# EasyEDA Pro project FishyUSBHub.epro

# Schematic Schematic1
Board Name: Board1; Create Date: 2026-07-10; Page Name: P1; Project Name: USB Hub; Schematic Name: Schematic1; Update Date: 2026-07-10; Company: EasyEDA.com; Page Size: A4; Version: V1.0
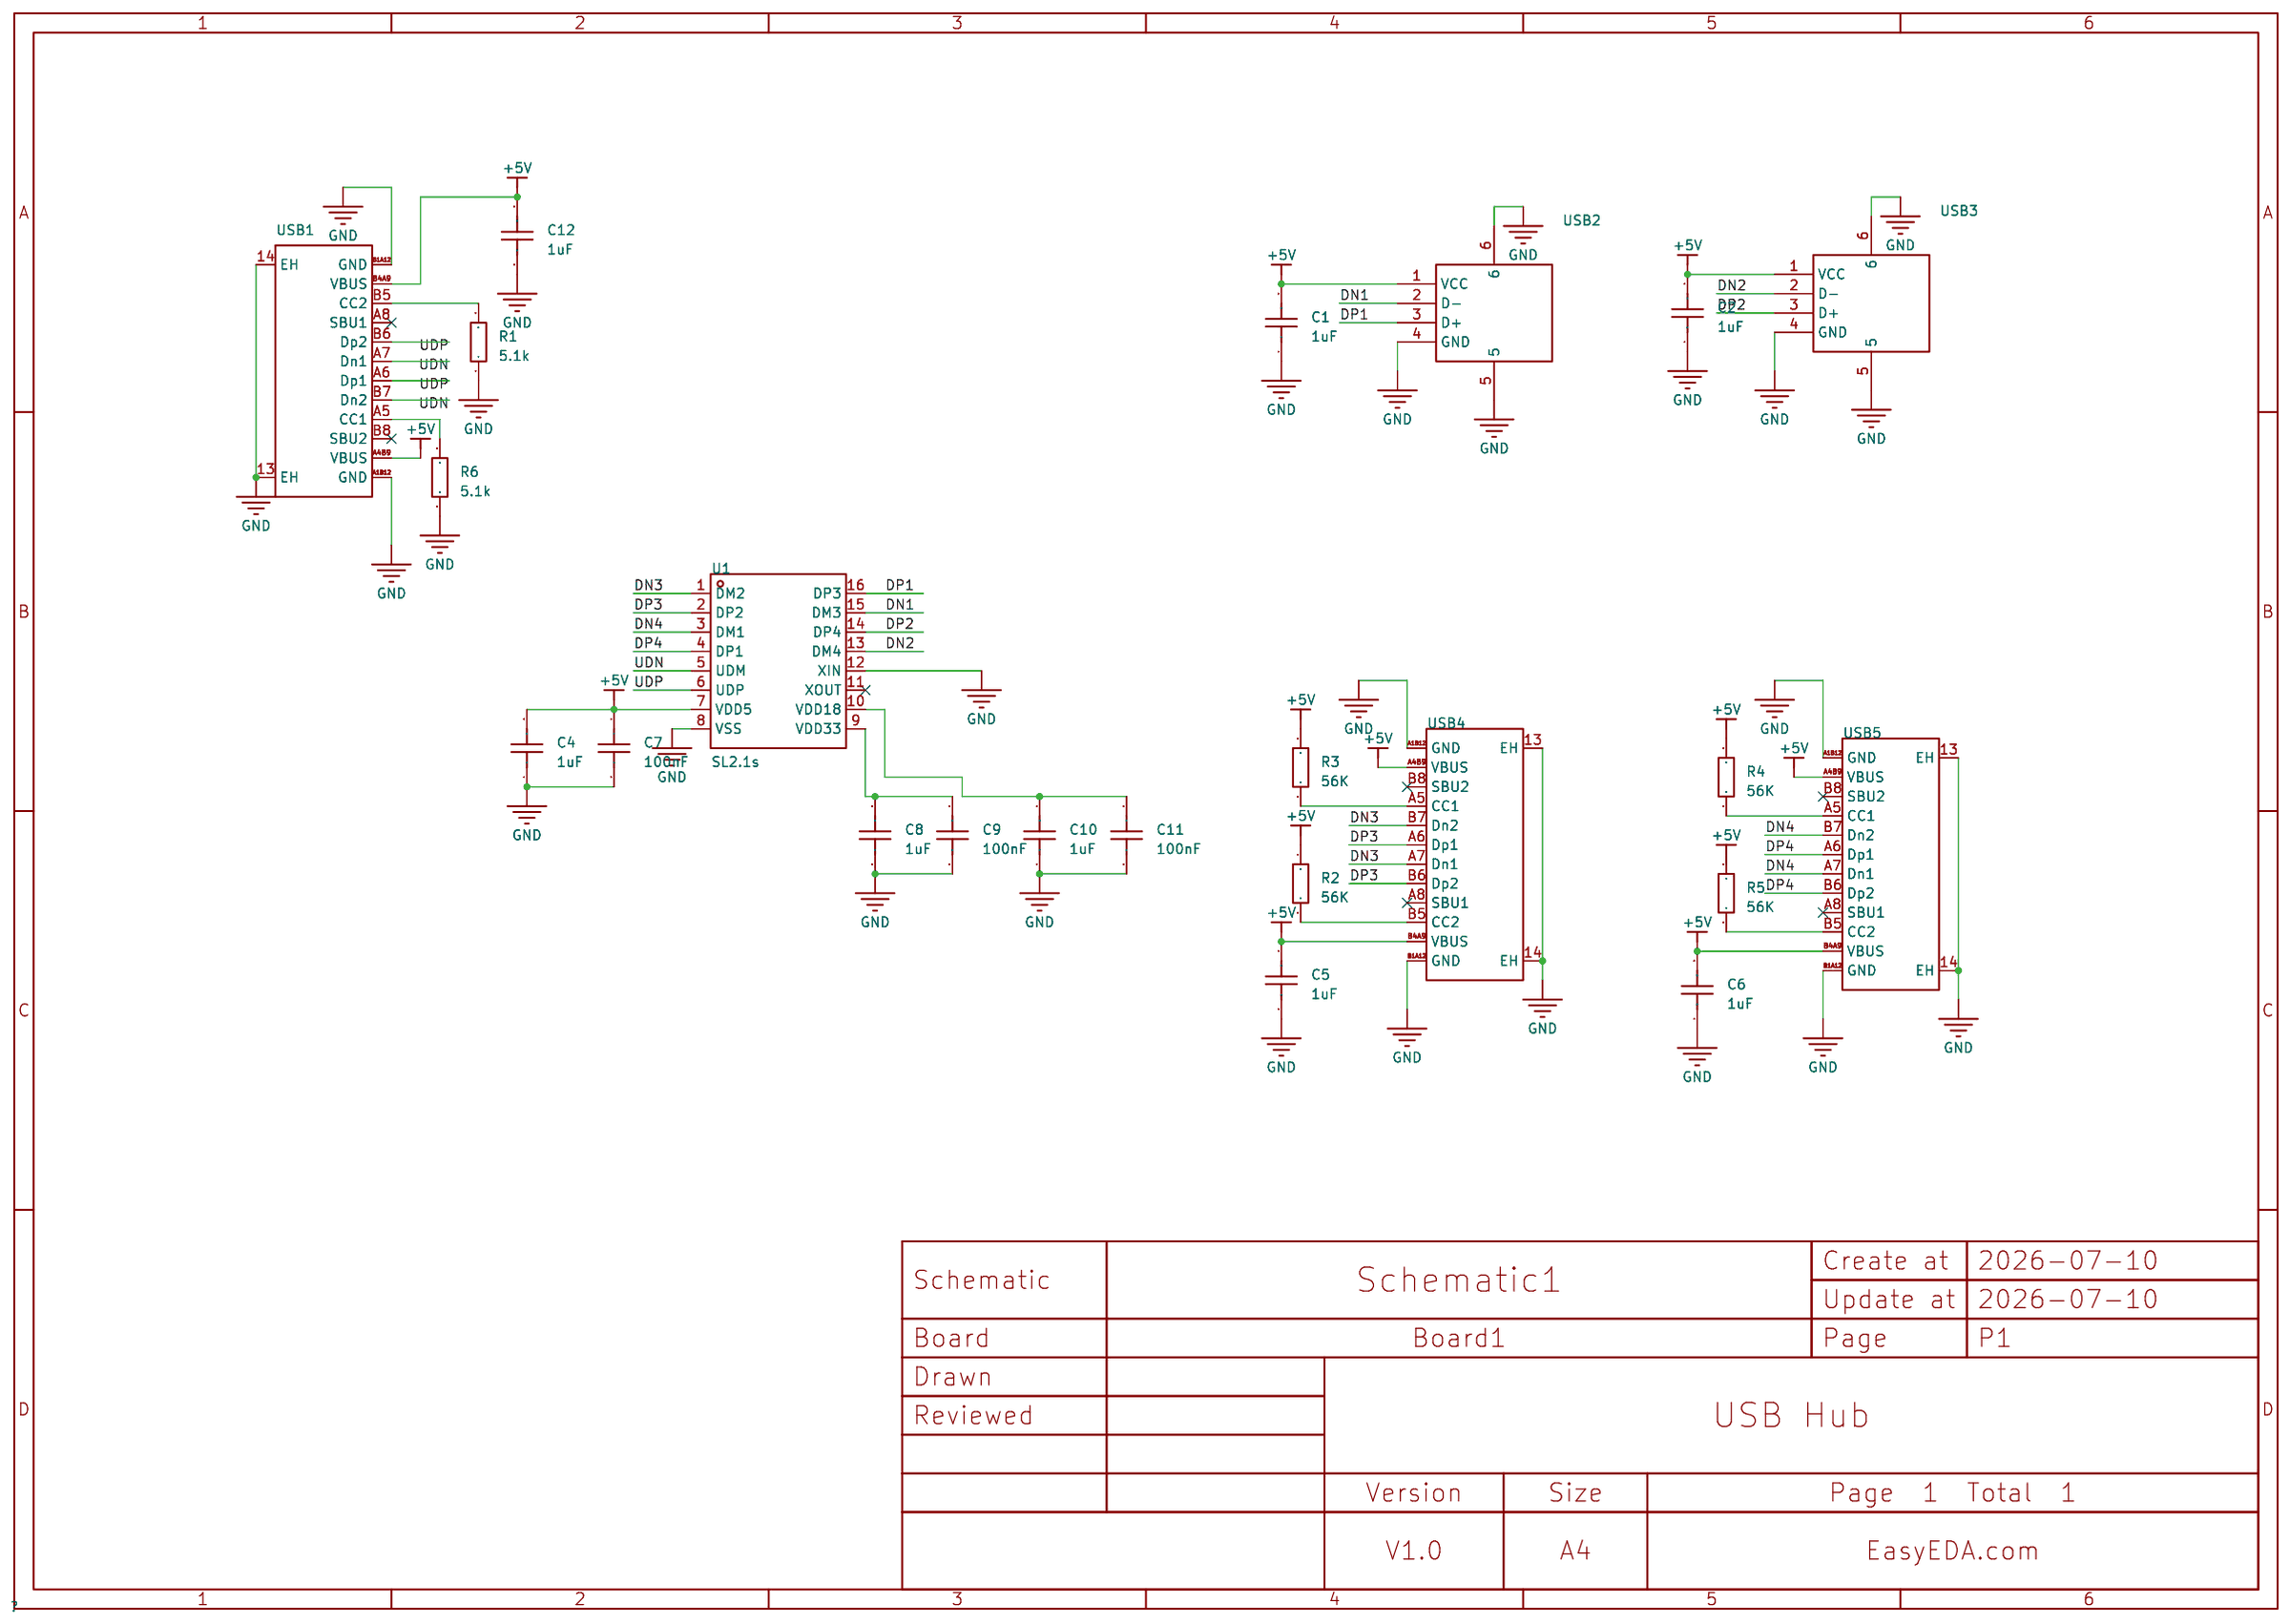
[diagram p0: schematic sheet]

## Parts
C1  1uF  [C0603]
C2  1uF  [C0603]
C4  1uF  [C0603]
C5  1uF  [C0603]
C6  1uF  [C0603]
C7  100nF  [C0603]
C8  1uF  [C0603]
C9  100nF  [C0603]
C10  1uF  [C0603]
C11  100nF  [C0603]
C12  1uF  [C0603]
R1  5.1k  [R0603]
R2  56K  [R0603]
R3  56K  [R0603]
R4  56K  [R0603]
R5  56K  [R0603]
R6  5.1k  [R0603]
U1  SL2.1s  [SSOP-16_L4.6-W2.6-P0.53-LS4.0-BL]
USB1  TYPE-C 16PIN 2MD(073)  [USB-C-SMD_TYPE-C-16PIN-2MD-073]
USB2  10.0 QHHTZB6.3  [USB-A-TH_10.0QHHTZB6.3]
USB3  10.0 QHHTZB6.3  [USB-A-TH_10.0QHHTZB6.3]
USB4  TYPE-C 16PIN 2MD(073)  [USB-C-SMD_TYPE-C-16PIN-2MD-073]
USB5  TYPE-C 16PIN 2MD(073)  [USB-C-SMD_TYPE-C-16PIN-2MD-073]

## Library data of the parts
C1 C2 C4-C12 = CAP_0603: Supplier Footprint: 0603
R1-R6 = Res_0603: Supplier Footprint: 0603
U1 = SL2.1s: type:Hub USB Protocol:USB 2.0 Data Rate:- Voltage - Supply:4V~5.25V Voltage - Supply:4V~5.25V Operating Temperature:0℃~+70℃ Operating Temperature:0℃~+70℃ Memory Interface:- Current - Supply:120mA Quiescent Supply Current:2.5mA Number of Channels:4; LCSC Part Name: USB2.0 HUB控制器集成电路; Supplier Part: C2684433; Manufacturer: CoreChips(和芯润德); Supplier Footprint: SSOP-16; JLCPCB Part Class: Extended Part; Datasheet: https://item.szlcsc.com/datasheet/SL2.1s/2782346.html; Supplier: LCSC; type: Hub; USB Protocol: USB 2.0; Voltage - Supply: 4V~5.25V; Operating Temperature: 0℃~+70℃; Current - Supply: 120mA; Quiescent Supply Current: 2.5mA; Number of Channels: 4
USB1 USB4 USB5 = TYPE-C 16PIN 2MD(073): Connector Type:Type-C Protocol Standard:- Gender:Female Mounting Type:Surface Mount, Right Angle Number of Contacts:16P Number of Ports:1 Current Rating-Power:3A Voltage Rating:5V Connect-Disconnect Life:10,000 Cycles Supplementary Features:- Center Heigh; LCSC Part Name: Type-C 母 卧贴; Supplier Part: C2765186; Manufacturer: SHOU HAN(首韩); Supplier Footprint: SMD; JLCPCB Part Class: Extended Part; Datasheet: https://item.szlcsc.com/datasheet/TYPE-C%252016PIN%25202MD(073)/2901843.html; Supplier: LCSC; Connector Type: Type-C; Gender: Female; Mounting Type: Surface Mount, Right Angle; Number of Contacts: 16P; Number of Ports: 1; Current Rating-Power: 3A; Voltage Rating: 5V; Connect-Disconnect Life: 10,000 Cycles; Detection color: Black; Operating Temperature: -25℃~+85℃
USB2 USB3 = 10.0 QHHTZB6.3: Connector Type:Type-A Protocol Standard:USB 2.0 Gender:Female Mounting Type:Surface Mount, Right Angle Number of Contacts:4P Number of Ports:1 Current Rating-Power:1.5A Voltage Rating:30V Connect-Disconnect Life:5,000 times Supplementary Features:- Center; LCSC Part Name: 壳长10.0mm; Supplier Part: C668591; Manufacturer: SHOU HAN(首韩); Supplier Footprint: SMD; JLCPCB Part Class: Extended Part; Datasheet: https://item.szlcsc.com/datasheet/10.0%2520QHHTZB6.3/698534.html; Supplier: LCSC; Connector Type: Type-A; Protocol Standard: USB 2.0; Gender: Female; Mounting Type: Surface Mount, Right Angle; Number of Contacts: 4P; Number of Ports: 1; Current Rating-Power: 1.5A; Voltage Rating: 30V; Connect-Disconnect Life: 5,000 times; Length: 10mm; Detection color: Black; Operating Temperature: -25℃~+85℃

## Nets
+5V: C1.2 C2.2 C4.2 C5.2 C6.2 C7.1 C12.2 R2.1 R3.1 R4.1 R5.1 U1.7(VDD5) USB1.A4B9(VBUS) USB1.B4A9(VBUS) USB2.1(VCC) USB3.1(VCC) USB4.A4B9(VBUS) USB4.B4A9(VBUS) USB5.A4B9(VBUS) USB5.B4A9(VBUS)
GND: C1.1 C2.1 C4.1 C5.1 C6.1 C7.2 C8.1 C9.2 C10.1 C11.2 C12.1 R1.1 R6.2 U1.8(VSS) U1.12(XIN) USB1.13(EH) USB1.14(EH) USB1.A1B12(GND) USB1.B1A12(GND) USB2.4(GND) USB2.5 USB2.6 USB3.4(GND) USB3.5 USB3.6 USB4.13(EH) USB4.14(EH) USB4.A1B12(GND) USB4.B1A12(GND) USB5.13(EH) USB5.14(EH) USB5.A1B12(GND) USB5.B1A12(GND)
DN1: U1.15(DM3) USB2.2(D-)
DN2: U1.13(DM4) USB3.2(D-)
DN3: U1.1(DM2) USB4.A7(Dn1) USB4.B7(Dn2)
DN4: U1.3(DM1) USB5.A7(Dn1) USB5.B7(Dn2)
DP1: U1.16(DP3) USB2.3(D+)
DP2: U1.14(DP4) USB3.3(D+)
DP3: U1.2(DP2) USB4.A6(Dp1) USB4.B6(Dp2)
DP4: U1.4(DP1) USB5.A6(Dp1) USB5.B6(Dp2)
UDN: U1.5(UDM) USB1.A7(Dn1) USB1.B7(Dn2)
UDP: U1.6(UDP) USB1.A6(Dp1) USB1.B6(Dp2)
$1N14: R2.2 USB4.B5(CC2)
$1N15: R3.2 USB4.A5(CC1)
$1N17: R4.2 USB5.A5(CC1)
$1N19: R5.2 USB5.B5(CC2)
$1N80: C8.2 C9.1 U1.9(VDD33)
$1N83: C10.2 C11.1 U1.10(VDD18)
$1N105: R1.2 USB1.B5(CC2)
$1N110: R6.1 USB1.A5(CC1)

Not connected (* = marked no-connect by the designer): U1 11(XOUT)*; USB1 A8(SBU1)* B8(SBU2)*; USB4 A8(SBU1)* B8(SBU2)*; USB5 A8(SBU1)* B8(SBU2)*

# Board PCB1
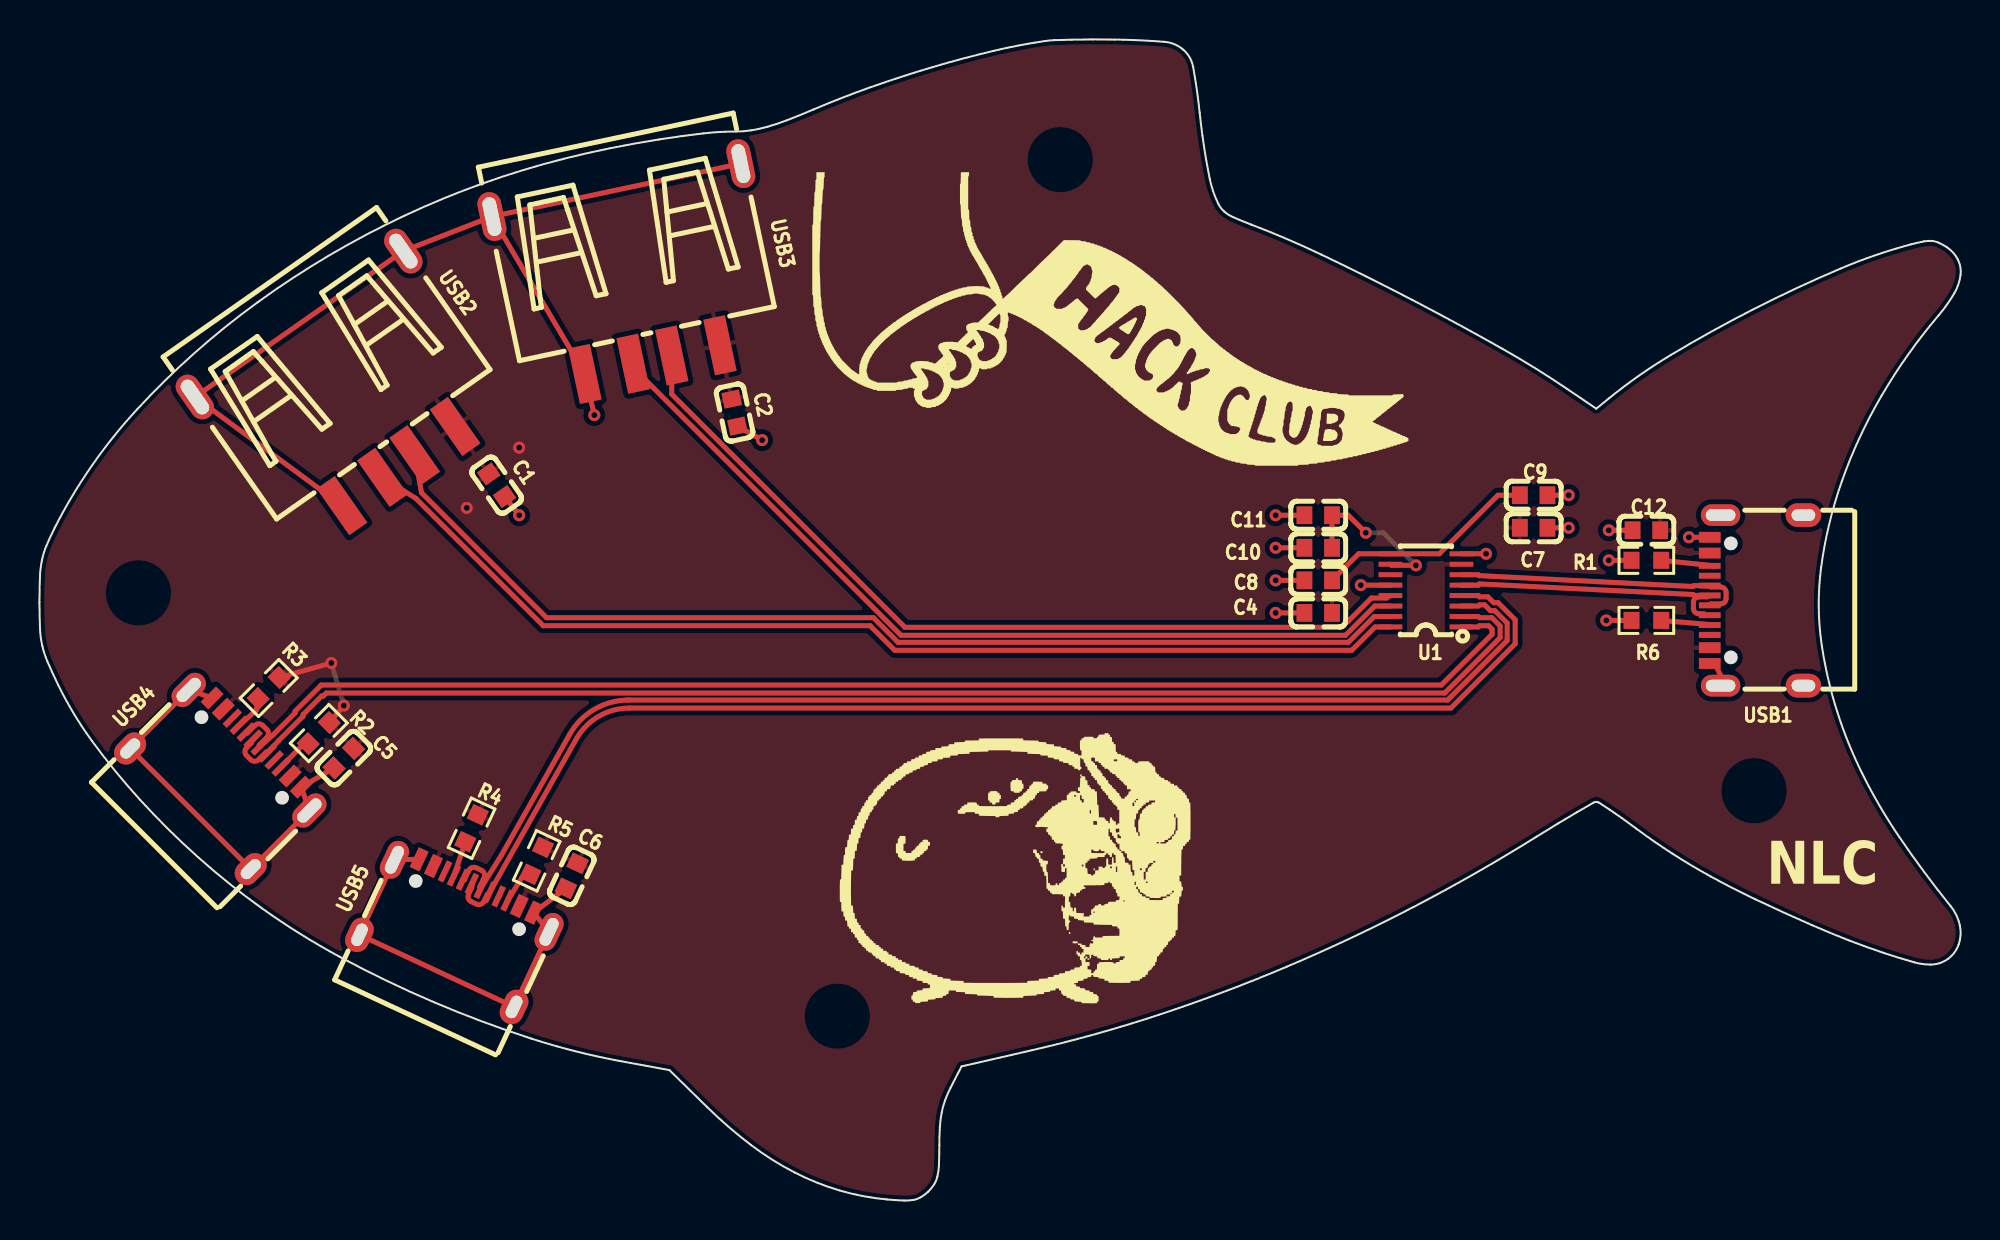
[diagram p1: board, top side]
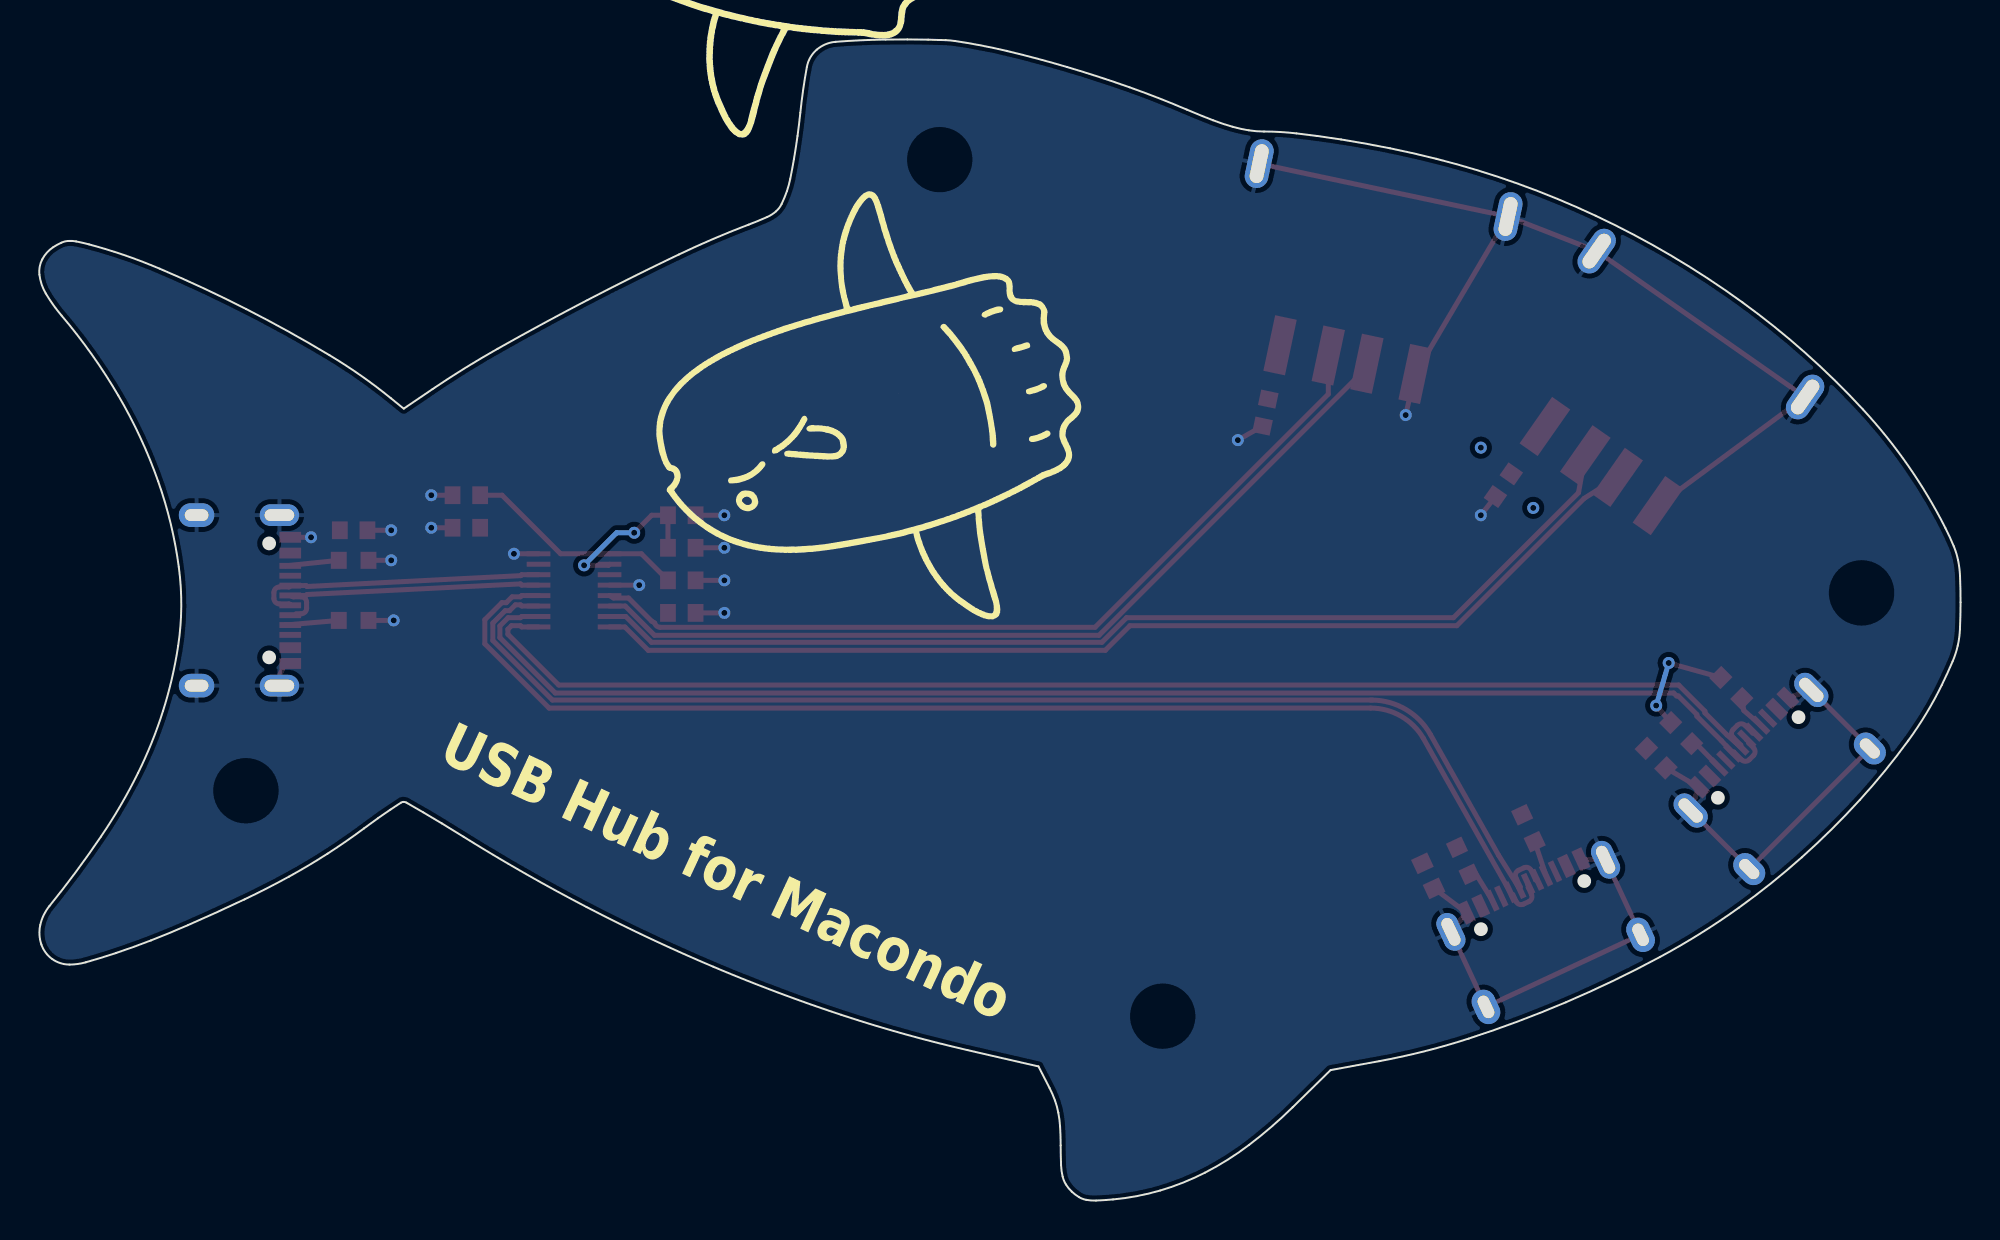
[diagram p2: board, bottom side, seen from below]

Outline 97.4 x 58.89 mm; copper layers: Top Layer, Bottom Layer. Coordinates in mm from the lower left corner of the outline.
Outline path: 0,30.35 arc(0.01,31.01) 0.03,31.67 arc(0.06,32.07) 0.13,32.48 arc(0.22,32.84) 0.34,33.19 arc(0.55,33.66) 0.77,34.12 arc(2.65,37.27) 4.95,40.12 arc(7.87,42.99) 11.06,45.56 arc(14.67,47.93) 18.49,49.95 arc(22.47,51.58) 26.58,52.84 arc(27.75,53.12) 28.93,53.37 arc(30.17,53.61) 31.4,53.82 arc(32.54,53.98) 33.67,54.12 arc(34.49,54.2) 35.31,54.22 arc(35.7,54.23) 36.09,54.28 arc(36.5,54.36) 36.91,54.46 arc(37.41,54.61) 37.9,54.79 arc(38.57,55.06) 39.23,55.33 arc(40.67,55.92) 42.13,56.46 arc(43.71,57) 45.29,57.49 arc(46.82,57.92) 48.37,58.31 arc(49.68,58.59) 51,58.81 arc(51.22,58.84) 51.45,58.85 arc(51.89,58.87) 52.34,58.88 arc(52.87,58.89) 53.4,58.89 arc(53.96,58.89) 54.51,58.88 arc(55.77,58.85) 57.03,58.77 arc(57.54,58.65) 57.99,58.37 arc(58.32,57.98) 58.49,57.49 arc(58.68,56.34) 58.82,55.17 arc(58.89,54.58) 58.97,54 arc(59.05,53.41) 59.15,52.83 arc(59.24,52.32) 59.34,51.82 arc(59.41,51.51) 59.5,51.2 arc(59.63,50.87) 59.77,50.55 arc(59.9,50.34) 60.06,50.17 arc(60.27,50.01) 60.51,49.88 arc(60.97,49.68) 61.44,49.5 arc(63.23,48.78) 64.98,47.98 arc(67.31,46.85) 69.62,45.67 arc(71.91,44.45) 74.18,43.2 arc(75.84,42.21) 77.46,41.16 78.93,40.16 79.59,40.7 arc(81.11,41.84) 82.7,42.88 arc(84.79,44.09) 86.93,45.22 arc(89.1,46.28) 91.31,47.26 arc(93.08,47.94) 94.89,48.5 arc(95.21,48.58) 95.54,48.65 arc(95.74,48.67) 95.95,48.67 arc(96.12,48.64) 96.29,48.58 arc(96.5,48.48) 96.7,48.36 arc(97.02,48.08) 97.26,47.73 arc(97.39,47.35) 97.4,46.95 arc(97.29,46.46) 97.08,46 arc(96.7,45.43) 96.28,44.89 arc(94.76,42.92) 93.41,40.84 arc(92.29,38.71) 91.38,36.48 arc(90.75,34.33) 90.34,32.13 arc(90.21,30.13) 90.37,28.13 arc(90.69,26.47) 91.14,24.84 arc(91.71,23.24) 92.4,21.68 arc(93.29,20.04) 94.28,18.46 arc(95.55,16.67) 96.9,14.93 arc(97.18,14.48) 97.36,13.98 arc(97.4,13.48) 97.3,12.99 arc(97.09,12.58) 96.75,12.25 arc(96.34,12.04) 95.88,11.97 arc(95.46,12) 95.05,12.08 arc(94.29,12.31) 93.53,12.55 arc(92.64,12.86) 91.75,13.19 arc(90.81,13.57) 89.87,13.97 arc(88.43,14.61) 87,15.28 arc(85.86,15.84) 84.74,16.43 arc(83.76,16.99) 82.8,17.59 arc(81.86,18.22) 80.95,18.88 arc(80.59,19.14) 80.24,19.39 arc(79.93,19.61) 79.61,19.83 arc(79.34,20) 79.07,20.18 arc(79.01,20.21) 78.94,20.22 arc(78.86,20.21) 78.79,20.18 arc(78.38,19.94) 77.96,19.7 arc(77.48,19.42) 77,19.13 arc(76.45,18.79) 75.9,18.45 arc(72.82,16.61) 69.67,14.89 arc(66.48,13.31) 63.24,11.86 arc(60.02,10.58) 56.75,9.42 arc(53.57,8.45) 50.35,7.63 46.75,6.81 46.19,5.71 arc(46.04,5.4) 45.92,5.08 arc(45.82,4.78) 45.74,4.46 arc(45.69,4.1) 45.65,3.74 arc(45.63,3.27) 45.62,2.8 arc(45.62,2.3) 45.6,1.79 arc(45.58,1.5) 45.52,1.22 arc(45.46,1.01) 45.36,0.82 arc(45.22,0.63) 45.06,0.46 arc(44.89,0.31) 44.7,0.18 arc(44.52,0.09) 44.33,0.04 arc(44.08,0.01) 43.84,0 arc(43.4,0.03) 42.97,0.06 arc(41.76,0.23) 40.58,0.51 arc(39.42,0.91) 38.3,1.42 arc(37.16,2.07) 36.08,2.82 arc(34.94,3.74) 33.86,4.73 31.94,6.62 29.47,7.07 arc(27.19,7.57) 24.94,8.22 arc(22.45,9.08) 20,10.06 arc(17.6,11.15) 15.25,12.35 arc(13.21,13.53) 11.25,14.85 arc(9.62,16.08) 8.05,17.41 arc(6.54,18.83) 5.11,20.32 arc(3.84,21.79) 2.65,23.33 arc(1.74,24.7) 0.95,26.15 arc(0.67,26.74) 0.4,27.35 arc(0.25,27.74) 0.14,28.14 arc(0.07,28.55) 0.03,28.97 arc(0.01,29.66) 0,30.35
Stack: Top Layer 0.035mm / Dielectric1 1.51mm FR4 er 4.5 / Bottom Layer 0.035mm

## Design rules (mm)
net DN2: DP3
net DP2: DP3
net DN1: DP2
net DP1: DP2
net UDP: DP1
net DN4: DP4
net DP4: DP4
net DP3: DP5
net DN3: DP5
net UDN: DP1
spacing copperThickness1oz (default): track to track 0.102, other pairs 0.152 to 0.3
spacing copperThickness2oz: track to track 0.203, other pairs 0.152 to 0.3
track width copperThickness1oz (default): min 0.127, default 0.254, max 2.54
track width copperThickness2oz: min 0.203, default 0.254, max 2.54
differential pair differentialPair (default): width min 0.127, default 0.254, max 2.54; gap min 0.152, default 0.152
net +5V uses copperRegion
net GND uses copperRegion

## Placement (name value [footprint] x y rotation side)
C1  1uF  [C0603]  23.18 36.28 125 top
C2  1uF  [C0603]  35.24 39.96 102 top
C4  1uF  [C0603]  64.83 29.8 0 top
C5  1uF  [C0603]  15.43 22.44 45 top
C6  1uF  [C0603]  26.99 16.47 65 top
C7  100nF  [C0603]  75.76 34.12 0 top
C8  1uF  [C0603]  64.83 31.46 0 top
C9  100nF  [C0603]  75.76 35.77 0 top
C10  1uF  [C0603]  64.83 33.11 0 top
C11  100nF  [C0603]  64.83 34.76 180 top
C12  1uF  [C0603]  81.47 34 0 top
R1  5.1k  [R0603]  81.47 32.47 0 top
R2  56K  [R0603]  14.16 23.71 225 top
R3  56K  [R0603]  11.62 25.99 225 top
R4  56K  [R0603]  21.91 18.88 245 top
R5  56K  [R0603]  25.21 17.23 245 top
R6  5.1k  [R0603]  81.47 29.42 180 top
U1  SL2.1s  [SSOP-16_L4.6-W2.6-P0.53-LS4.0-BL]  70.3 30.95 90 top
USB1  TYPE-C 16PIN 2MD(073)  [USB-C-SMD_TYPE-C-16PIN-2MD-073#3]  87.06 30.44 90 top
USB2  10.0 QHHTZB6.3  [USB-A-TH_10.0QHHTZB6.3]  15.69 40.85 215 top
USB3  10.0 QHHTZB6.3  [USB-A-TH_10.0QHHTZB6.3]  30.16 46.95 192 top
USB4  TYPE-C 16PIN 2MD(073)  [USB-C-SMD_TYPE-C-16PIN-2MD-073]  9.34 21.55 315 top
USB5  TYPE-C 16PIN 2MD(073)  [USB-C-SMD_TYPE-C-16PIN-2MD-073#2]  21.15 13.8 335 top

## Footprints (pads in the part's own frame, mm; a bottom-side part is the same pattern mirrored in y, then rotated)
C0603
  rect 0.8x0.9 smd: 1(-0.7,0) 2(0.7,0)
R0603
  rect 0.806x0.864 smd: 1(-0.753,0) 2(0.753,0)
SSOP-16_L4.6-W2.6-P0.53-LS4.0-BL
  rect 0.25x1.2 smd: 1(-1.855,-1.8) 2(-1.325,-1.8) 3(-0.795,-1.8) 4(-0.265,-1.8) 5(0.265,-1.8) 6(0.795,-1.8) 7(1.325,-1.8) 8(1.855,-1.8) 9(1.855,1.8) 10(1.325,1.8) 11(0.795,1.8) 12(0.265,1.8) 13(-0.265,1.8) 14(-0.795,1.8) 15(-1.325,1.8) 16(-1.855,1.8)
USB-A-TH_10.0QHHTZB6.3
  rect 1.12x2.88 smd: 1(-3.5,4.395) 2(-1,4.395) 3(1,4.395) 4(3.5,4.395)
  oval 1.2x2.5 hole 0.7x2: 5(-6.45,-4.395) 6(6.45,-4.395)
USB-C-SMD_TYPE-C-16PIN-2MD-073
  oval 1.1x2 hole 0.6x1.5: 13(-4.325,1.825) 14(4.325,1.825)
  oval 1.2x1.8 hole 0.6x1.2: 13(-4.325,-2.375) 14(4.325,-2.375)
  rect 0.55x1.1 smd: A1B12(-3.2,2.375) A4B9(-2.4,2.375) B1A12(3.2,2.375) B4A9(2.4,2.375)
  rect 0.3x1.1 smd: A5(-1.25,2.375) A6(-0.25,2.375) A7(0.25,2.375) A8(1.25,2.375) B5(1.75,2.375) B6(0.75,2.375) B7(-0.75,2.375) B8(-1.75,2.375)
USB-C-SMD_TYPE-C-16PIN-2MD-073#2
  oval 1.1x2 hole 0.6x1.5: 13(-4.325,1.825) 14(4.325,1.825)
  oval 1.2x1.8 hole 0.6x1.2: 13(-4.325,-2.375) 14(4.325,-2.375)
  rect 0.55x1.1 smd: A1B12(-3.2,2.375) A4B9(-2.4,2.375) B1A12(3.2,2.375) B4A9(2.4,2.375)
  rect 0.3x1.1 smd: A5(-1.25,2.375) A6(-0.25,2.375) A7(0.25,2.375) A8(1.25,2.375) B5(1.75,2.375) B6(0.75,2.375) B7(-0.75,2.375) B8(-1.75,2.375)
USB-C-SMD_TYPE-C-16PIN-2MD-073#3
  oval 1.1x2 hole 0.6x1.5: 13(-4.325,1.825) 14(4.325,1.825)
  oval 1.2x1.8 hole 0.6x1.2: 13(-4.325,-2.375) 14(4.325,-2.375)
  rect 0.55x1.1 smd: A1B12(-3.2,2.375) A4B9(-2.4,2.375) B1A12(3.2,2.375) B4A9(2.4,2.375)
  rect 0.3x1.1 smd: A5(-1.25,2.375) A6(-0.25,2.375) A7(0.25,2.375) A8(1.25,2.375) B5(1.75,2.375) B6(0.75,2.375) B7(-0.75,2.375) B8(-1.75,2.375)

## Nets
As in the schematic.

Pads without a net: U1 11; USB1 A8 B8; USB4 A8 B8; USB5 A8 B8

## Via types
v1: diameter 0.61, hole 0.305, Top Layer to Bottom Layer, 21 vias

## Routing (per net, layer and track width the routed paths; a pad name or vN(x,y) marks a point on that pad's centre or on a via; arc(x,y) is an arc through that point)
+5V: length 6.1
  Top Layer w0.254: v1(14.8,27.26) R3.1 ; R2.1 v1(15.43,25.11)
  Bottom Layer w0.254: v1(15.43,25.11) v1(14.8,27.26)
  vias: v1(21.66,35.13) v1(24.32,38.19)
GND: length 114
  Top Layer w0.254: v1(28.13,39.84) USB3.4 22.94,49.91 ; R1.1 v1(79.57,32.47) ; 85.49,26.11 84.94,27.24 ; R6.2 v1(79.44,29.42) ; C12.1 v1(79.57,34) ; U1.8 v1(73.34,32.8) ; C8.1 v1(62.68,31.46) ; USB2.4 USB2.6 USB2.5 22.94,49.91 ; 84.94,33.64 v1(83.63,33.64) ; USB4.A1B12 USB4.13 USB4.13 USB4.14 13.69,19.78 USB4.B1A12 C5.1 ; 19.25,17.31 USB5.13 USB5.13 24.06,9.82 USB5.14 USB5.B1A12 C6.1 ; 76.46,34.12 v1(77.53,34.12) ; C10.1 v1(62.68,33.11) ; 22.94,49.91 USB3.5 ; U1.12 v1(66.99,31.21) ; 76.46,35.77 v1(77.53,35.77) ; C1.1 v1(24.32,34.76) ; C2.1 v1(36.64,38.57) ; C4.1 v1(62.68,29.8) ; C11.2 v1(62.68,34.76)
DN1: length 54.8
  Top Layer w0.254: USB2.2 19.37,35.9 25.71,29.56 42.28,29.56 43.53,28.31 66.37,28.31 67.68,29.62 U1.15
DN2: length 43.9
  Top Layer w0.254: USB3.2 32.06,40.9 43.88,29.08 65.93,29.08 arc(66.11,29.14) 66.21,29.29 66.36,29.38 67.53,30.56 68.29,30.56 U1.13
DN3: length 69.2
  Top Layer w0.254: U1.1 72.95,29.09 73.01,29.15 73.47,29.15 73.65,28.97 73.65,28.72 71.08,26.15 14.29,26.15 12.96,24.82 12.96,24.73 11.84,23.61 USB4.A7 11.14,23.1 11.53,23.49 arc(11.61,23.69) 11.53,23.89 11.32,24.1 arc(11.12,24.18) 10.92,24.1 10.53,23.71 USB4.B7
DN4: length 64.4
  Top Layer w0.254: U1.3 72.95,30.15 73.01,30.21 73.27,30.21 73.56,29.92 73.79,29.92 74.41,29.29 74.41,28.4 71.39,25.38 29.92,25.38 arc(29.87,25.38) 29.82,25.38 arc(28.12,24.9) 26.88,23.64 23.43,17.52 USB5.A7 arc(22.35,15.88) 22.32,15.9 22.55,16.38 arc(22.55,16.59) 22.41,16.75 22.14,16.88 arc(21.93,16.88) 21.77,16.74 21.55,16.26 arc(21.51,16.27) USB5.B7
DP1: length 55.1
  Top Layer w0.254: U1.16 67.72,29.09 66.53,27.91 43.36,27.91 42.11,29.15 25.54,29.15 19.08,35.61 USB2.3
DP2: length 44.8
  Top Layer w0.254: U1.14 67.7,30.15 66.22,28.67 43.68,28.67 30.1,42.25 USB3.3
DP3: length 70.1
  Top Layer w0.254: U1.2 72.95,29.62 73.01,29.56 73.64,29.56 74.06,29.14 74.06,28.55 71.24,25.74 14.54,25.74 14.39,25.59 14.31,25.59 13.37,24.65 13.37,24.57 12.13,23.33 USB4.B6 11.5,22.75 11.11,22.36 arc(10.91,22.28) 10.71,22.36 10.5,22.57 arc(10.42,22.77) 10.5,22.97 10.74,23.2 10.74,23.27 10.85,23.39 10.84,23.41
DP4: length 65.1
  Top Layer w0.254: USB5.B6 27.24,23.45 arc(28.37,24.57) 29.91,24.98 71.56,24.98 74.82,28.24 74.82,29.46 73.95,30.32 73.73,30.32 73.43,30.62 73.01,30.62 72.95,30.68 U1.4 ; 22.7,15.53 22.53,15.17 arc(22.38,15.02) 22.16,15.03 21.89,15.16 arc(21.75,15.32) 21.76,15.53 21.92,15.88 arc(21.92,15.97) 21.95,16.06 arc(21.94,16.06) USB5.A6
UDN: length 14.7
  Top Layer w0.254: U1.5 72.95,31.21 73.01,31.27 83.83,30.74 83.88,30.69 USB1.A7 arc(84.61,30.64) 84.51,30.62 84.14,30.62 arc(83.94,30.54) 83.86,30.34 83.86,30.04 arc(83.94,29.84) 84.14,29.76 84.39,29.76
UDP: length 15
  Top Layer w0.254: U1.6 72.95,31.74 73,31.69 83.83,31.14 83.88,31.19 USB1.B6 arc(84.71,31.14) 84.76,31.12 85.23,31.12 arc(85.43,31.04) 85.51,30.84 85.51,30.54 arc(85.43,30.34) 85.23,30.26 84.76,30.26 arc(84.72,30.25) 84.68,30.23 USB1.A6
$1N14: length 1.8
  Top Layer w0.254: 12.25,21.99 13.53,23.3
$1N15: length 1.7
  Top Layer w0.254: USB4.A5 10.99,24.85 R3.2
$1N17: length 1.8
  Top Layer w0.254: USB5.A5 R4.2
$1N19: length 1.7
  Top Layer w0.254: 23.74,15.22 24.64,16.68
$1N80: length 11.3
  Top Layer w0.254: C8.2 66.88,32.8 U1.9 70.98,32.8 73.95,35.77 C9.1
$1N83: length 8.3
  Top Layer w0.254: U1.10 68.55,32.22 v1(69.79,32.22) ; C10.2 C11.1 66.36,34.76 v1(67.25,33.87)
  Bottom Layer w0.254: v1(67.25,33.87) 68.14,33.87 v1(69.79,32.22)
$1N105: length 2.7
  Top Layer w0.254: R1.2 84.94,32.19
$1N110: length 2.7
  Top Layer w0.254: R6.1 84.94,29.19

## Copper pours and planes (outline as drawn; the poured copper is in the pictures)
+5V on Top Layer: -18.22,67.9 103.44,67.9 103.44,-8.68 -18.22,-8.68
+5V on Top Layer: -15.68,68.16 106.74,68.16 106.74,-8.68 -15.68,-8.68
GND on Bottom Layer: -15.68,67.9 105.22,67.9 105.22,-8.04 -15.68,-8.04

## Text on the board
Bottom Silkscreen Layer: USB Hub for Macondo
Top Silkscreen Layer: NLC
